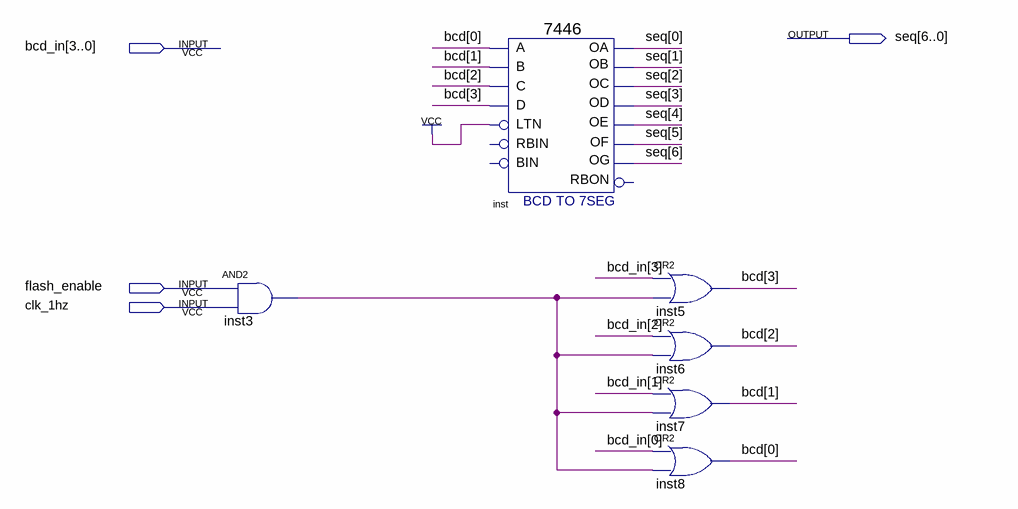
[diagram p0: schematic sheet]
// Quartus schematic bcd_2_hex.bdf as structural Verilog: 6 symbols, 4 pins
module bcd_2_hex (
  input  [3:0] bcd_in,
  input  flash_enable,
  input  clk_1hz,
  output [6:0] seq
);

  wire inst3_out;
  wire [3:0] bcd;

  and inst3 (inst3_out, flash_enable, clk_1hz);
  \7446  inst (
    .D(bcd[3]), .C(bcd[2]), .B(bcd[1]), .LTN(1'b1), .A(bcd[0]), .OC(seq[2]), .OD(seq[3]), .OE(seq[4]),
    .OA(seq[0]), .OB(seq[1]), .OF(seq[5]), .OG(seq[6]));  // open: RBIN, BIN, RBON
  or inst5 (bcd[3], bcd_in[3], inst3_out);
  or inst6 (bcd[2], bcd_in[2], inst3_out);
  or inst7 (bcd[1], bcd_in[1], inst3_out);
  or inst8 (bcd[0], bcd_in[0], inst3_out);
endmodule
